# Altium schematic sheet Top_schematic.SchDoc
size A4; DocumentNumber: 1; SheetNumber: 1; SheetTotal: 7
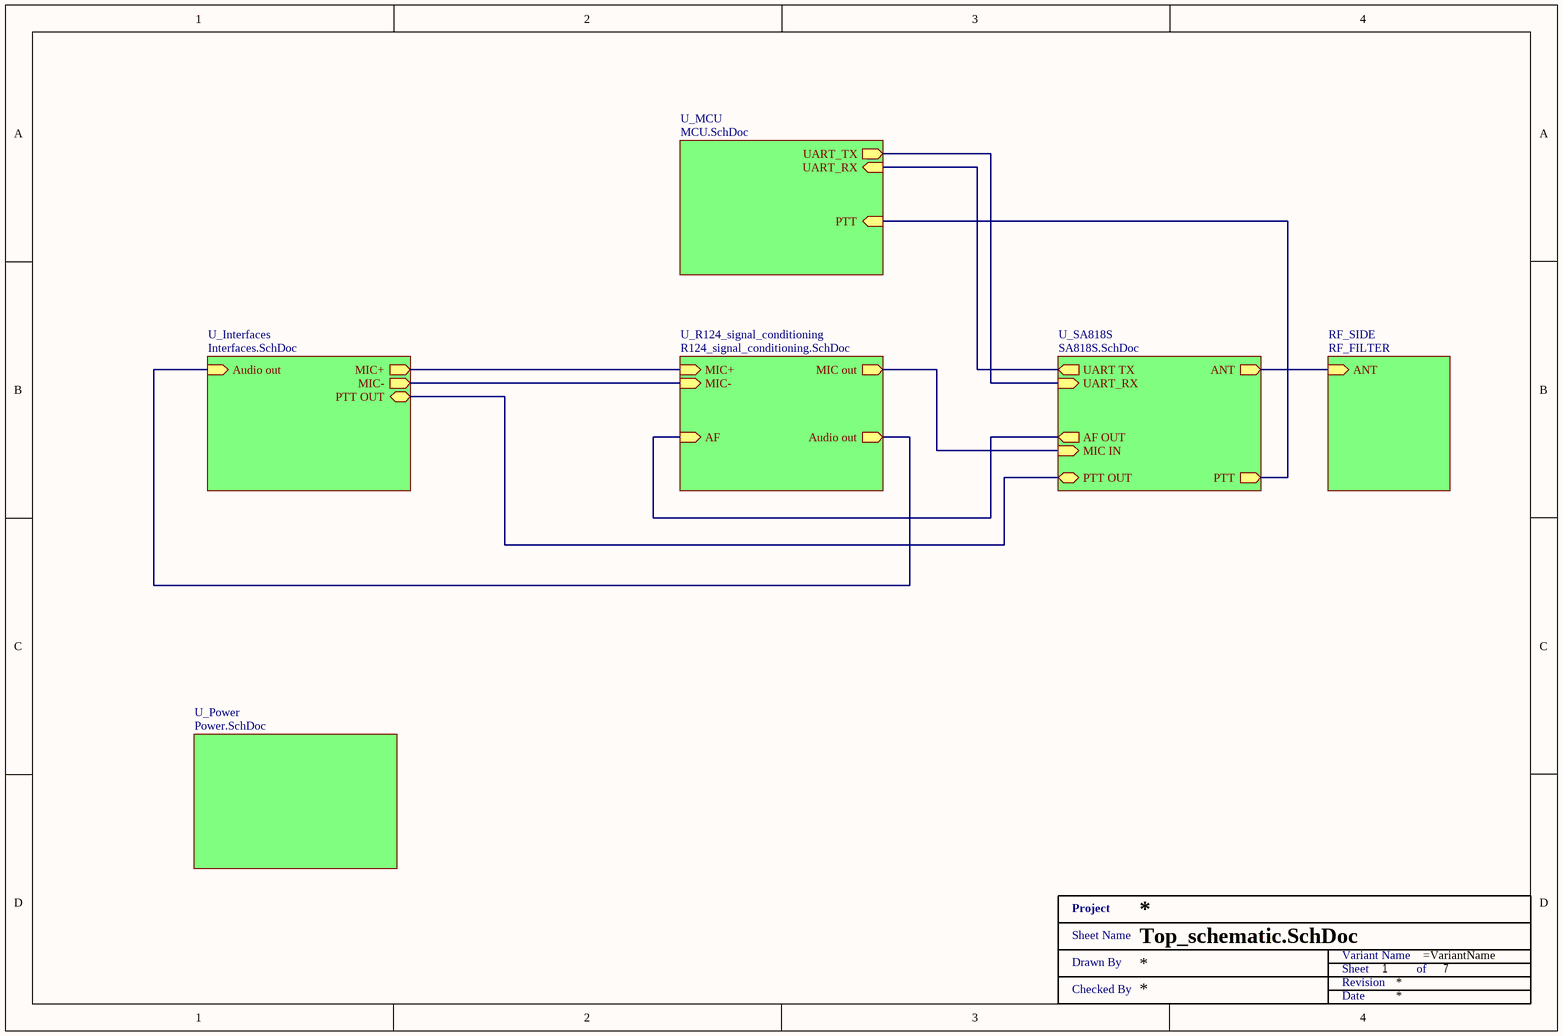
[diagram p0: Top_schematic.SchDoc]

## Parts
XX?  Title 1  (value not drawn)  (graphical)

## Sub-sheets
RF_SIDE = RF_FILTER: ANT (in)
U_Interfaces = Interfaces.SchDoc: MIC+ (out), MIC- (out), Audio out (in), PTT OUT (bidir)
U_MCU = MCU.SchDoc: UART_TX (out), UART_RX (in), PTT (in)
U_Power = Power.SchDoc: no entries
U_R124_signal_conditioning = R124_signal_conditioning.SchDoc: MIC+ (in), MIC- (in), MIC out (out), AF (in), Audio out (out)
U_SA818S = SA818S.SchDoc: ANT (out), UART_RX (in), UART TX (out), AF OUT (out), MIC IN (in), PTT OUT (bidir), PTT (out)

## Nets
(unnamed): sheet U_R124_signal_conditioning/MIC+, sheet U_Interfaces/MIC+
(unnamed): sheet U_R124_signal_conditioning/MIC-, sheet U_Interfaces/MIC-
(unnamed): sheet U_R124_signal_conditioning/MIC out, sheet U_SA818S/MIC IN
(unnamed): sheet U_R124_signal_conditioning/AF, sheet U_SA818S/AF OUT
(unnamed): sheet U_R124_signal_conditioning/Audio out, sheet U_Interfaces/Audio out
(unnamed): sheet U_SA818S/ANT, sheet RF_SIDE/ANT
(unnamed): sheet U_SA818S/UART_RX, sheet U_MCU/UART_TX
(unnamed): sheet U_SA818S/UART TX, sheet U_MCU/UART_RX
(unnamed): sheet U_SA818S/PTT OUT, sheet U_Interfaces/PTT OUT
(unnamed): sheet U_SA818S/PTT, sheet U_MCU/PTT

## Notes on the sheet
- (in symbol Title 1) Project; Sheet Name; Variant Name; Drawn By; Sheet; of; Revision; Checked By; Date